# Altium schematic sheet top.SchDoc
size A
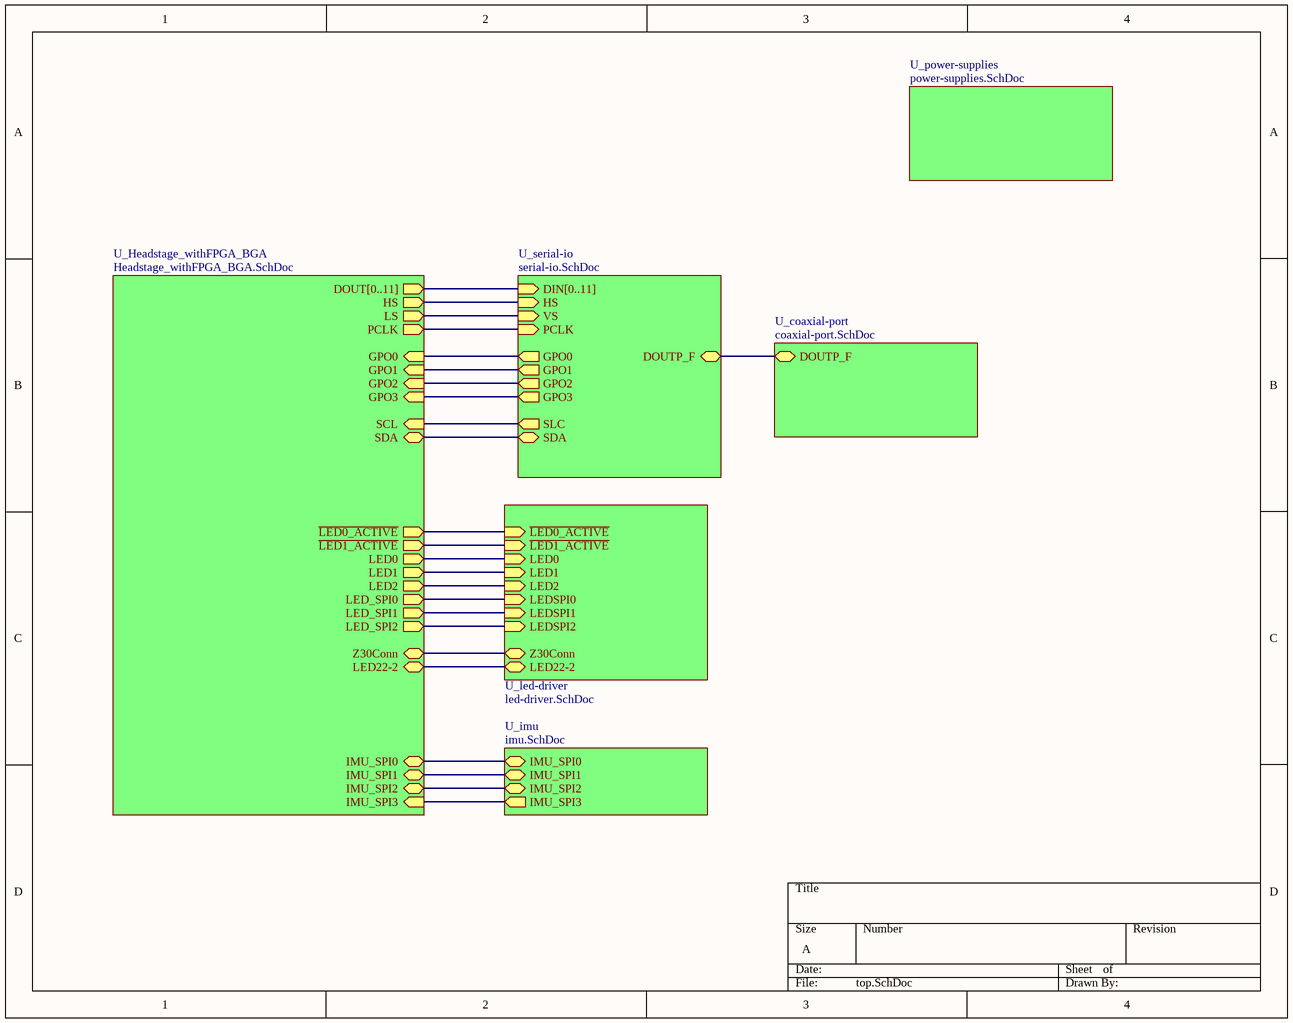
[diagram p0: top.SchDoc]

## Sub-sheets
U_coaxial-port = coaxial-port.SchDoc: DOUTP_F (bidir)
U_Headstage_withFPGA_BGA = Headstage_withFPGA_BGA.SchDoc: DOUT[0..11] (out), HS (out), LS (out), PCLK (out), GPO3 (in), GPO2 (in), GPO1 (in), SDA (bidir), SCL (in), GPO0 (in), ~{LED0_ACTIVE} (out), ~{LED1_ACTIVE} (out), LED0 (out), LED1 (out), LED2 (out), LED_SPI0 (out), LED_SPI1 (out), LED_SPI2 (out), Z30Conn (bidir), IMU_SPI0 (bidir), IMU_SPI1 (bidir), IMU_SPI2 (bidir), IMU_SPI3 (in), LED22-2
U_imu = imu.SchDoc: IMU_SPI0 (bidir), IMU_SPI1 (bidir), IMU_SPI2 (bidir), IMU_SPI3 (out)
U_led-driver = led-driver.SchDoc: ~{LED0_ACTIVE} (in), ~{LED1_ACTIVE} (in), LEDSPI0 (in), LED0 (in), LED1 (in), LED2 (in), LEDSPI1 (in), LEDSPI2 (in), Z30Conn (bidir), LED22-2
U_power-supplies = power-supplies.SchDoc: no entries
U_serial-io = serial-io.SchDoc: DIN[0..11] (in), HS (in), VS (in), PCLK (in), DOUTP_F (bidir), SDA (bidir), SLC (out), GPO0 (out), GPO1 (out), GPO2 (out), GPO3 (out)

## Nets
(unnamed): sheet U_coaxial-port/DOUTP_F, sheet U_serial-io/DOUTP_F
(unnamed): sheet U_serial-io/HS, sheet U_Headstage_withFPGA_BGA/HS
(unnamed): sheet U_serial-io/VS, sheet U_Headstage_withFPGA_BGA/LS
(unnamed): sheet U_serial-io/PCLK, sheet U_Headstage_withFPGA_BGA/PCLK
(unnamed): sheet U_serial-io/SDA, sheet U_Headstage_withFPGA_BGA/SDA
(unnamed): sheet U_serial-io/SLC, sheet U_Headstage_withFPGA_BGA/SCL
(unnamed): sheet U_serial-io/GPO0, sheet U_Headstage_withFPGA_BGA/GPO0
(unnamed): sheet U_serial-io/GPO1, sheet U_Headstage_withFPGA_BGA/GPO1
(unnamed): sheet U_serial-io/GPO2, sheet U_Headstage_withFPGA_BGA/GPO2
(unnamed): sheet U_serial-io/GPO3, sheet U_Headstage_withFPGA_BGA/GPO3
(unnamed): sheet U_Headstage_withFPGA_BGA/~{LED0_ACTIVE}, sheet U_led-driver/~{LED0_ACTIVE}
(unnamed): sheet U_Headstage_withFPGA_BGA/~{LED1_ACTIVE}, sheet U_led-driver/~{LED1_ACTIVE}
(unnamed): sheet U_Headstage_withFPGA_BGA/LED0, sheet U_led-driver/LED0
(unnamed): sheet U_Headstage_withFPGA_BGA/LED1, sheet U_led-driver/LED1
(unnamed): sheet U_Headstage_withFPGA_BGA/LED2, sheet U_led-driver/LED2
(unnamed): sheet U_Headstage_withFPGA_BGA/LED_SPI0, sheet U_led-driver/LEDSPI0
(unnamed): sheet U_Headstage_withFPGA_BGA/LED_SPI1, sheet U_led-driver/LEDSPI1
(unnamed): sheet U_Headstage_withFPGA_BGA/LED_SPI2, sheet U_led-driver/LEDSPI2
(unnamed): sheet U_Headstage_withFPGA_BGA/Z30Conn, sheet U_led-driver/Z30Conn
(unnamed): sheet U_Headstage_withFPGA_BGA/IMU_SPI0, sheet U_imu/IMU_SPI0
(unnamed): sheet U_Headstage_withFPGA_BGA/IMU_SPI1, sheet U_imu/IMU_SPI1
(unnamed): sheet U_Headstage_withFPGA_BGA/IMU_SPI2, sheet U_imu/IMU_SPI2
(unnamed): sheet U_Headstage_withFPGA_BGA/IMU_SPI3, sheet U_imu/IMU_SPI3
(unnamed): sheet U_Headstage_withFPGA_BGA/LED22-2, sheet U_led-driver/LED22-2

## Buses and harness runs
bus sheet U_Headstage_withFPGA_BGA/DOUT[0..11] = sheet U_serial-io/DIN[0..11]